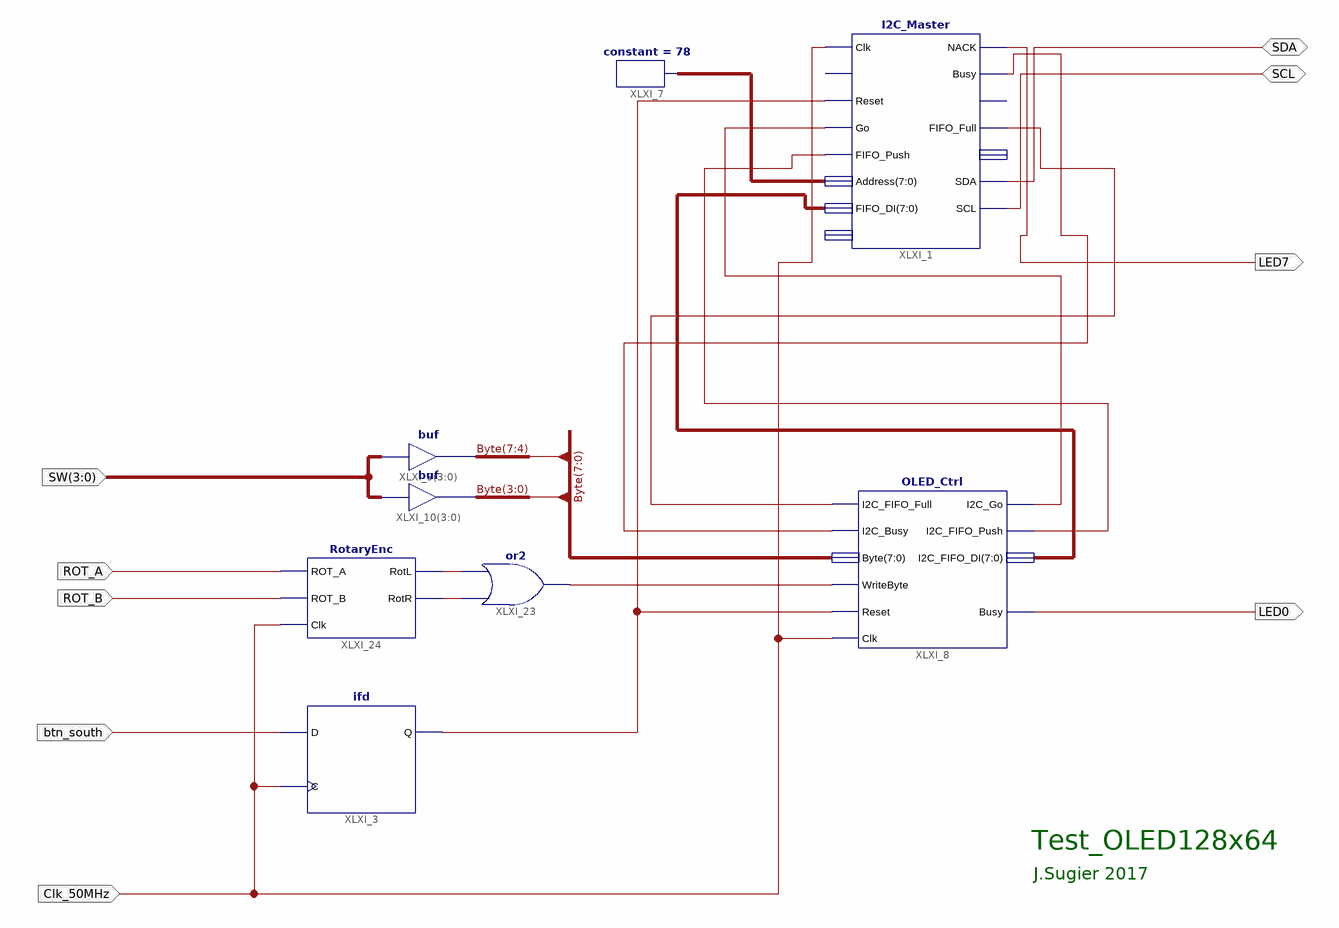
[diagram p0: schematic sheet 1]
// Xilinx ISE schematic top.sch (spartan3e) as structural Verilog: 8 symbols, 9 ports
module top (
  input  btn_south,
  input  Clk_50MHz,
  input  ROT_B,
  input  ROT_A,
  input  [3:0] SW,
  inout  SDA,
  inout  SCL,
  output LED7,
  output LED0
);

  wire XLXN_53, XLXN_140, XLXN_141, XLXN_156, XLXN_158, XLXN_159, XLXN_161, XLXN_163;
  wire [7:0] Byte, XLXN_51, XLXN_164;

  constant #(.CValue("78")) XLXI_7 (.O(XLXN_164));
  I2C_Master XLXI_1 (
    .Clk(Clk_50MHz), .Reset(XLXN_163), .Go(XLXN_161), .FIFO_Push(XLXN_159), .Address(XLXN_164),
    .FIFO_DI(XLXN_51), .NACK(LED7), .Busy(XLXN_158), .FIFO_Full(XLXN_53), .SDA(SDA), .SCL(SCL));  // open: FIFO_Pop, ReadCnt, FIFO_Empty, FIFO_DO
  OLED_Ctrl XLXI_8 (
    .Clk(Clk_50MHz), .Reset(XLXN_163), .I2C_FIFO_Full(XLXN_53), .I2C_Busy(XLXN_158), .WriteByte(XLXN_156),
    .Byte(Byte), .I2C_Go(XLXN_161), .I2C_FIFO_Push(XLXN_159), .I2C_FIFO_DI(XLXN_51), .Busy(LED0));
  ifd XLXI_3 (.C(Clk_50MHz), .D(btn_south), .Q(XLXN_163));
  or XLXI_23 (XLXN_156, XLXN_141, XLXN_140);
  assign Byte[7:4] = SW;  // buf XLXI_9[3..0], 4 bits wide
  assign Byte[3:0] = SW;  // buf XLXI_10[3..0], 4 bits wide
  RotaryEnc XLXI_24 (.ROT_A(ROT_A), .ROT_B(ROT_B), .RotL(XLXN_140), .RotR(XLXN_141), .Clk(Clk_50MHz));

  // Notes on the sheet:
  //   Test_OLED128x64
  //   J.Sugier 2017
endmodule
